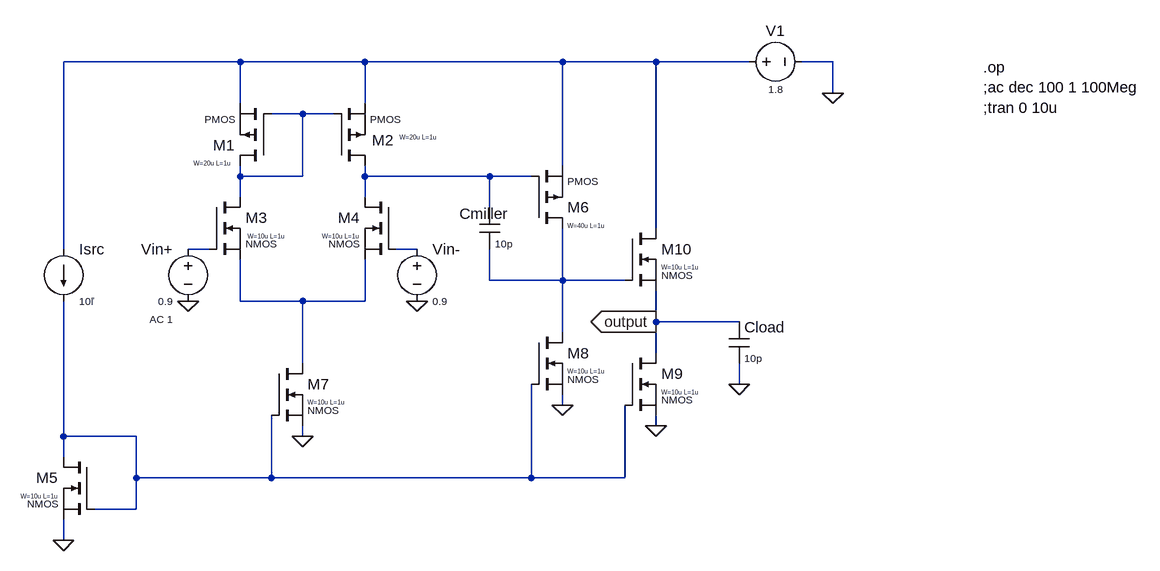
[diagram p0: schematic Twostage_opamp.asc]
Twostage_opamp.asc, the LTspice schematic file:
Version 4.1
SHEET 1 1536 820
WIRE 128 64 -144 64
WIRE 320 64 128 64
WIRE 624 64 320 64
WIRE 768 64 624 64
WIRE 912 64 768 64
WIRE 1040 64 992 64
WIRE 1040 112 1040 64
WIRE 128 128 128 64
WIRE 320 128 320 64
WIRE 224 144 176 144
WIRE 272 144 224 144
WIRE 624 224 624 64
WIRE 128 240 128 224
WIRE 224 240 224 144
WIRE 224 240 128 240
WIRE 320 240 320 224
WIRE 512 240 320 240
WIRE 576 240 512 240
WIRE 128 272 128 240
WIRE 320 272 320 240
WIRE 512 288 512 240
WIRE 768 320 768 64
WIRE -144 352 -144 64
WIRE 80 352 48 352
WIRE 400 352 368 352
WIRE 512 400 512 352
WIRE 624 400 624 320
WIRE 624 400 512 400
WIRE 720 400 624 400
WIRE 128 432 128 368
WIRE 224 432 128 432
WIRE 320 432 320 368
WIRE 320 432 224 432
WIRE 768 464 768 416
WIRE 896 464 768 464
WIRE 624 480 624 400
WIRE 768 512 768 464
WIRE 224 528 224 432
WIRE 896 560 896 528
WIRE 624 592 624 576
WIRE 768 624 768 608
WIRE -144 640 -144 432
WIRE -32 640 -144 640
WIRE 224 640 224 624
WIRE -144 672 -144 640
WIRE -32 704 -32 640
WIRE 176 704 176 608
WIRE 176 704 -32 704
WIRE 576 704 576 560
WIRE 576 704 176 704
WIRE 720 704 720 592
WIRE 720 704 576 704
WIRE -32 752 -32 704
WIRE -32 752 -96 752
WIRE -144 800 -144 768
FLAG -144 800 0
FLAG 224 640 0
FLAG 624 592 0
FLAG 768 624 0
FLAG 1040 112 0
FLAG 48 432 0
FLAG 400 432 0
FLAG 896 560 0
FLAG 768 464 output
IOPIN 768 464 Out
SYMBOL voltage 896 64 R270
WINDOW 0 32 56 VTop 2
WINDOW 3 -32 56 VBottom 1
WINDOW 123 0 0 Left 0
WINDOW 39 0 0 Left 0
SYMATTR InstName V1
SYMATTR Value 1.8
SYMBOL pmos 176 224 R180
WINDOW 3 56 72 Left 1
WINDOW 39 120 4 Right 0
SYMATTR SpiceLine W=20u L=1u
SYMATTR InstName M1
SYMBOL pmos 272 224 M180
WINDOW 0 76 24 Top 2
WINDOW 3 56 72 Left 1
WINDOW 39 159 44 Right 0
SYMATTR InstName M2
SYMATTR SpiceLine W=20u L=1u
SYMBOL nmos 80 272 R0
WINDOW 3 56 72 Left 1
WINDOW 39 88 54 Top 0
SYMATTR SpiceLine W=10u L=1u
SYMATTR InstName M3
SYMBOL nmos 368 272 M0
WINDOW 3 56 72 Left 1
WINDOW 39 56 60 Left 0
SYMATTR SpiceLine W=10u L=1u
SYMATTR InstName M4
SYMBOL current -144 352 R0
WINDOW 3 24 80 Left 1
WINDOW 123 0 0 Left 0
WINDOW 39 0 0 Left 0
SYMATTR Value 10ľ
SYMATTR InstName Isrc
SYMBOL nmos -96 672 M0
WINDOW 3 56 72 Left 1
WINDOW 39 56 60 Left 0
SYMATTR SpiceLine W=10u L=1u
SYMATTR InstName M5
SYMBOL pmos 576 320 M180
WINDOW 3 56 72 Left 1
WINDOW 39 56 4 Left 0
SYMATTR SpiceLine W=40u L=1u
SYMATTR InstName M6
SYMBOL nmos 176 528 R0
WINDOW 3 56 72 Left 1
WINDOW 39 56 60 Left 0
SYMATTR SpiceLine W=10u L=1u
SYMATTR InstName M7
SYMBOL nmos 576 480 R0
WINDOW 3 56 72 Left 1
WINDOW 39 56 60 Left 0
SYMATTR SpiceLine W=10u L=1u
SYMATTR InstName M8
SYMBOL nmos 720 512 R0
WINDOW 3 56 72 Left 1
WINDOW 39 56 60 Left 0
SYMATTR SpiceLine W=10u L=1u
SYMATTR InstName M9
SYMBOL nmos 720 320 R0
WINDOW 3 56 72 Left 1
WINDOW 39 56 60 Left 0
SYMATTR SpiceLine W=10u L=1u
SYMATTR InstName M10
SYMBOL voltage 48 336 M0
WINDOW 3 24 96 Left 1
WINDOW 123 24 124 Left 1
WINDOW 39 0 0 Left 0
SYMATTR Value 0.9
SYMATTR Value2 AC 1
SYMATTR InstName Vin+
SYMBOL voltage 400 336 R0
WINDOW 3 24 96 Left 1
SYMATTR Value 0.9
SYMATTR InstName Vin-
SYMBOL cap 880 464 R0
WINDOW 3 24 56 Left 1
SYMATTR Value 10p
SYMATTR InstName Cload
SYMBOL cap 496 288 R0
WINDOW 0 7 -6 Top 2
WINDOW 3 24 56 Left 1
SYMATTR InstName Cmiller
SYMATTR Value 10p
TEXT 1272 72 Left 2 !.op\n;ac dec 100 1 100Meg\n;tran 0 10u

The netlist it stands for:
* Twostage_opamp.asc
V1 N001 0 1.8
M1 N002 N002 N001 N001 PMOS W=20u L=1u
M2 N003 N002 N001 N001 PMOS W=20u L=1u
M3 N002 N004 N007 N007 NMOS W=10u L=1u
M4 N003 N005 N007 N007 NMOS W=10u L=1u
Isrc N001 N008 10ľ
M5 N008 N008 0 0 NMOS W=10u L=1u
M6 N006 N003 N001 N001 PMOS W=40u L=1u
M7 N007 N008 0 0 NMOS W=10u L=1u
M8 N006 N008 0 0 NMOS W=10u L=1u
M9 output N008 0 0 NMOS W=10u L=1u
M10 N001 N006 output output NMOS W=10u L=1u
Vin+ N004 0 0.9 AC 1
Vin- N005 0 0.9
Cload output 0 10p
Cmiller N003 N006 10p
.model NMOS NMOS
.model PMOS PMOS
.lib standard.mos
.op
;ac dec 100 1 100Meg
;tran 0 10u
.backanno
.end